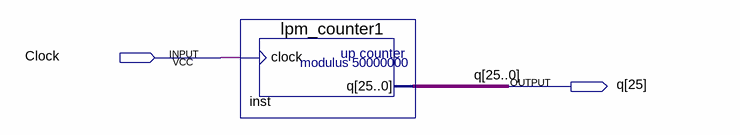
[diagram p0: schematic sheet]
// Quartus schematic frequency.bdf as structural Verilog: 1 symbols, 2 pins
module frequency (
  input  Clock,
  output [25:0] q
);

  lpm_counter1 inst (.clock(Clock), .q(q));
endmodule
